# Altium schematic sheet 10_FPGA_power.SchDoc: FPGA power
size A3; Organization: Lime Microsystems; Address1: Surrey Tech Centre; Address2: Guildford GU2 7YG; Address3: Surrey; Address4: United Kingdom; Revision: SoDeRa-PCI v1.0; SheetNumber: 10; SheetTotal: 15
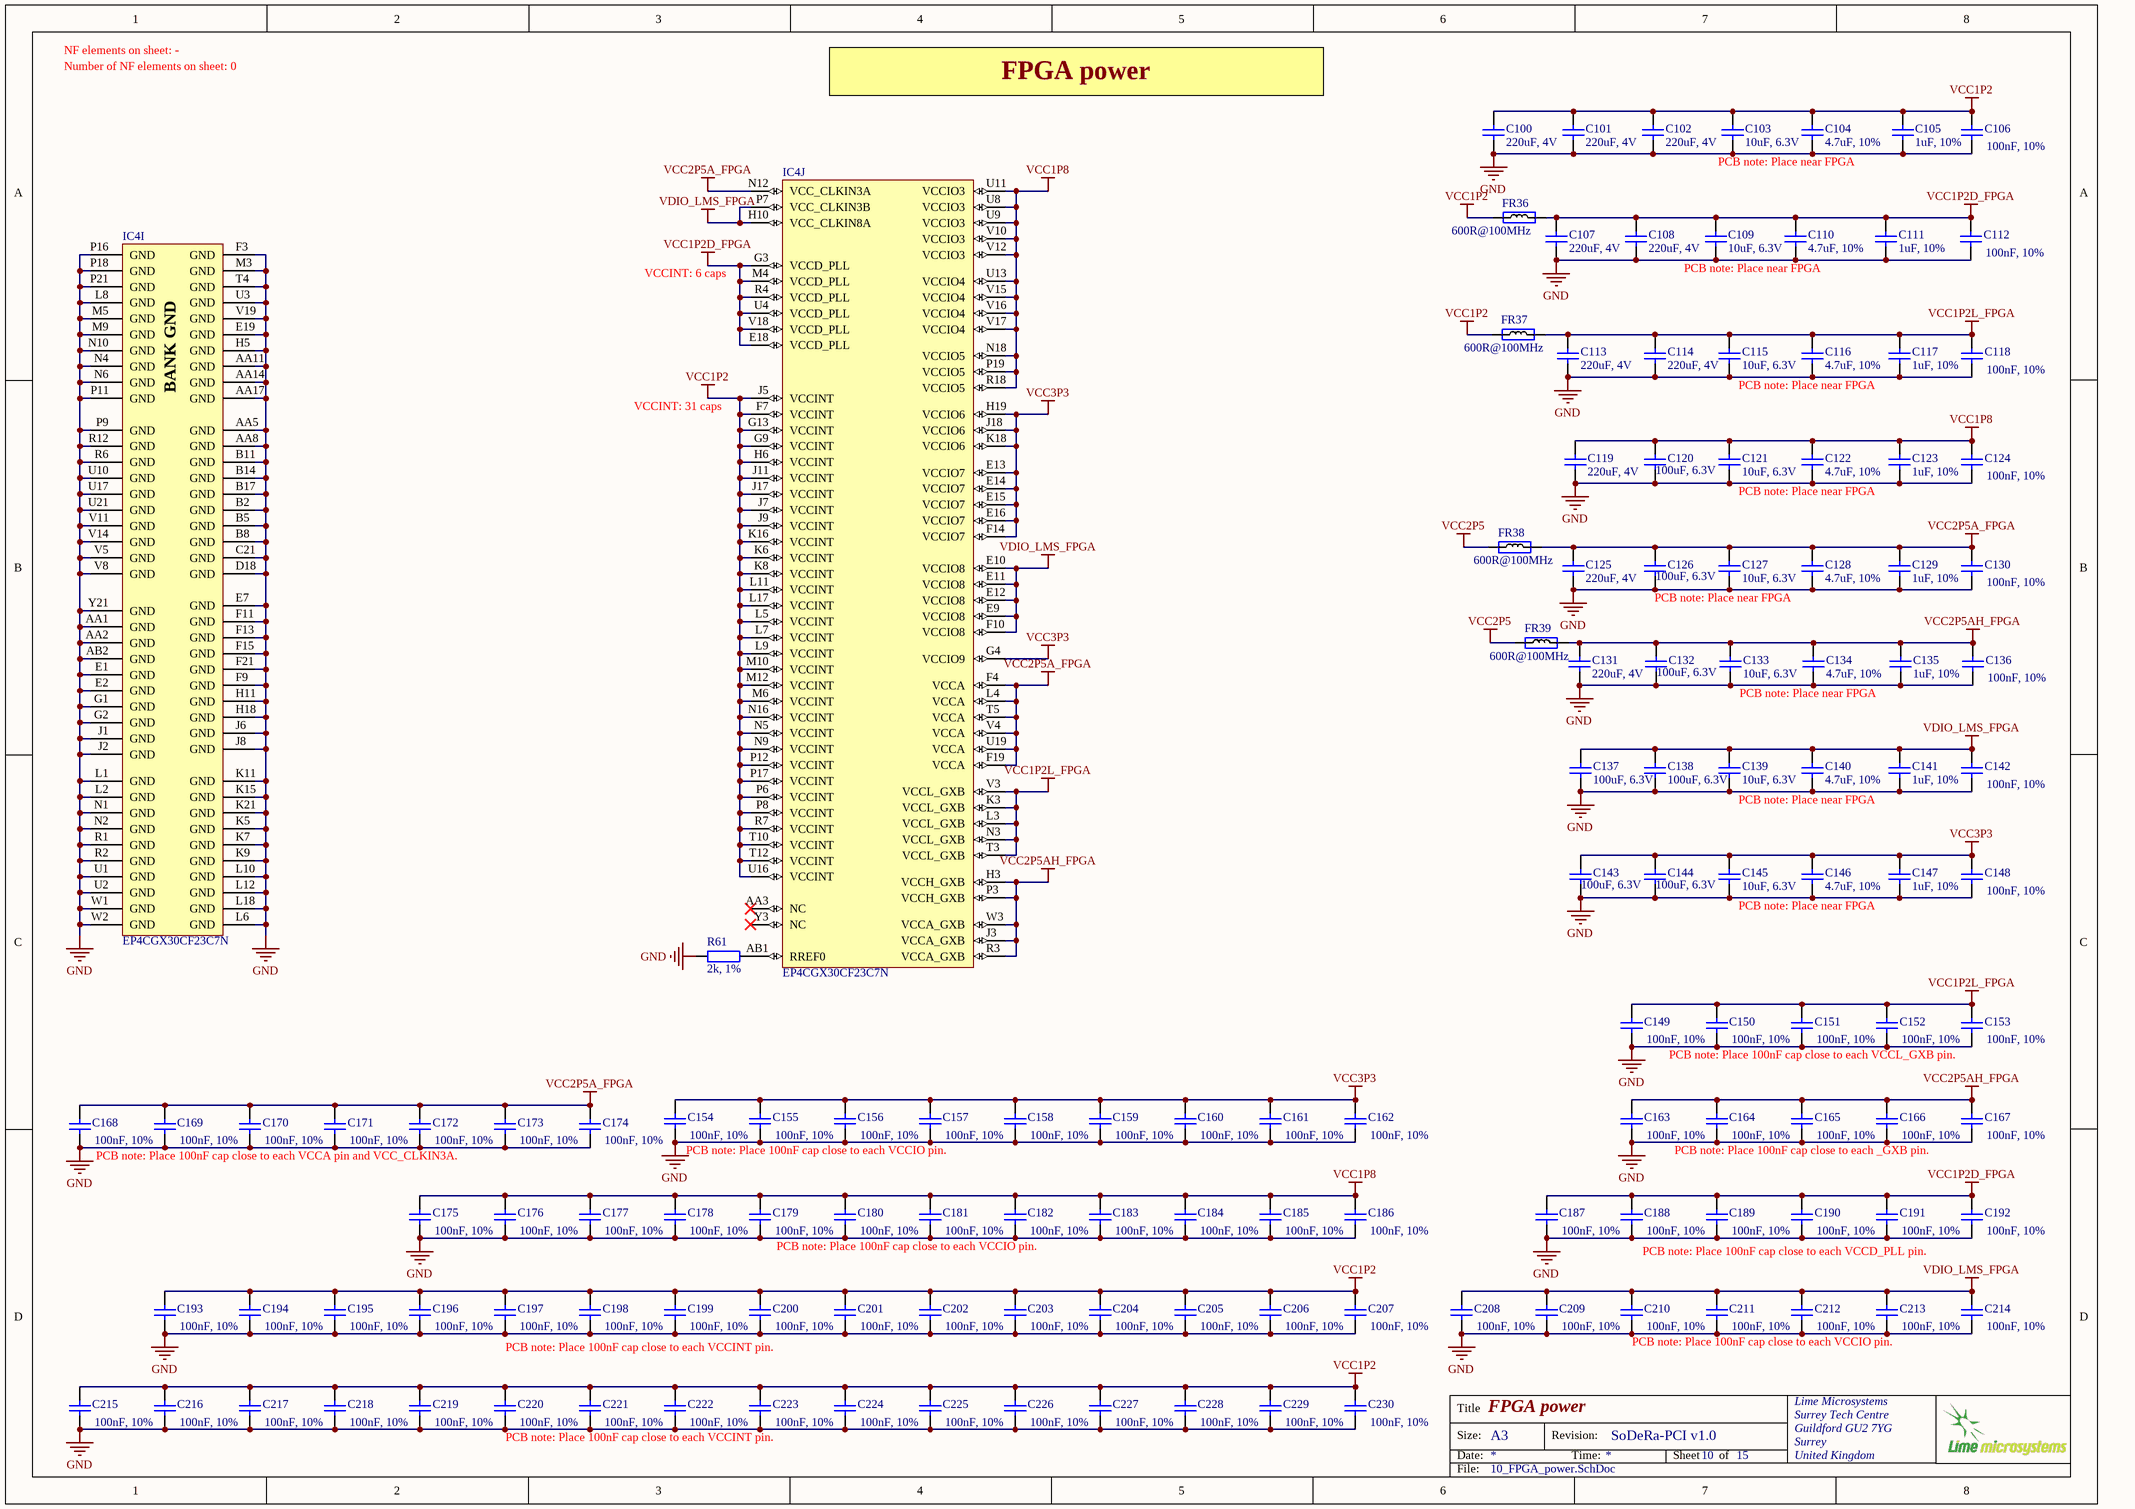
[diagram p0: 10_FPGA_power.SchDoc]

## Parts
C100  220uF, 4V  [CAP1206]
C101  220uF, 4V  [CAP1206]
C102  220uF, 4V  [CAP1206]
C103  10uF, 6.3V  [CAP0603]
C104  4.7uF, 10%  [CAP0603]
C105  1uF, 10%  [CAP0402]
C106  100nF, 10%  [CAP0402]
C107  220uF, 4V  [CAP1206]
C108  220uF, 4V  [CAP1206]
C109  10uF, 6.3V  [CAP0603]
C110  4.7uF, 10%  [CAP0603]
C111  1uF, 10%  [CAP0402]
C112  100nF, 10%  [CAP0402]
C113  220uF, 4V  [CAP1206]
C114  220uF, 4V  [CAP1206]
C115  10uF, 6.3V  [CAP0603]
C116  4.7uF, 10%  [CAP0603]
C117  1uF, 10%  [CAP0402]
C118  100nF, 10%  [CAP0402]
C119  220uF, 4V  [CAP1206]
C120  100uF, 6.3V  [CAP1206]
C121  10uF, 6.3V  [CAP0603]
C122  4.7uF, 10%  [CAP0603]
C123  1uF, 10%  [CAP0402]
C124  100nF, 10%  [CAP0402]
C125  220uF, 4V  [CAP1206]
C126  100uF, 6.3V  [CAP1206]
C127  10uF, 6.3V  [CAP0603]
C128  4.7uF, 10%  [CAP0603]
C129  1uF, 10%  [CAP0402]
C130  100nF, 10%  [CAP0402]
C131  220uF, 4V  [CAP1206]
C132  100uF, 6.3V  [CAP1206]
C133  10uF, 6.3V  [CAP0603]
C134  4.7uF, 10%  [CAP0603]
C135  1uF, 10%  [CAP0402]
C136  100nF, 10%  [CAP0402]
C137  100uF, 6.3V  [CAP1206]
C138  100uF, 6.3V  [CAP1206]
C139  10uF, 6.3V  [CAP0603]
C140  4.7uF, 10%  [CAP0603]
C141  1uF, 10%  [CAP0402]
C142  100nF, 10%  [CAP0402]
C143  100uF, 6.3V  [CAP1206]
C144  100uF, 6.3V  [CAP1206]
C145  10uF, 6.3V  [CAP0603]
C146  4.7uF, 10%  [CAP0603]
C147  1uF, 10%  [CAP0402]
C148  100nF, 10%  [CAP0402]
C149  100nF, 10%  [CAP0402]
C150  100nF, 10%  [CAP0402]
C151  100nF, 10%  [CAP0402]
C152  100nF, 10%  [CAP0402]
C153  100nF, 10%  [CAP0402]
C154  100nF, 10%  [CAP0402]
C155  100nF, 10%  [CAP0402]
C156  100nF, 10%  [CAP0402]
C157  100nF, 10%  [CAP0402]
C158  100nF, 10%  [CAP0402]
C159  100nF, 10%  [CAP0402]
C160  100nF, 10%  [CAP0402]
C161  100nF, 10%  [CAP0402]
C162  100nF, 10%  [CAP0402]
C163  100nF, 10%  [CAP0402]
C164  100nF, 10%  [CAP0402]
C165  100nF, 10%  [CAP0402]
C166  100nF, 10%  [CAP0402]
C167  100nF, 10%  [CAP0402]
C168  100nF, 10%  [CAP0402]
C169  100nF, 10%  [CAP0402]
C170  100nF, 10%  [CAP0402]
C171  100nF, 10%  [CAP0402]
C172  100nF, 10%  [CAP0402]
C173  100nF, 10%  [CAP0402]
C174  100nF, 10%  [CAP0402]
C175  100nF, 10%  [CAP0402]
C176  100nF, 10%  [CAP0402]
C177  100nF, 10%  [CAP0402]
C178  100nF, 10%  [CAP0402]
C179  100nF, 10%  [CAP0402]
C180  100nF, 10%  [CAP0402]
C181  100nF, 10%  [CAP0402]
C182  100nF, 10%  [CAP0402]
C183  100nF, 10%  [CAP0402]
C184  100nF, 10%  [CAP0402]
C185  100nF, 10%  [CAP0402]
C186  100nF, 10%  [CAP0402]
C187  100nF, 10%  [CAP0402]
C188  100nF, 10%  [CAP0402]
C189  100nF, 10%  [CAP0402]
C190  100nF, 10%  [CAP0402]
C191  100nF, 10%  [CAP0402]
C192  100nF, 10%  [CAP0402]
C193  100nF, 10%  [CAP0402]
C194  100nF, 10%  [CAP0402]
C195  100nF, 10%  [CAP0402]
C196  100nF, 10%  [CAP0402]
C197  100nF, 10%  [CAP0402]
C198  100nF, 10%  [CAP0402]
C199  100nF, 10%  [CAP0402]
C200  100nF, 10%  [CAP0402]
C201  100nF, 10%  [CAP0402]
C202  100nF, 10%  [CAP0402]
C203  100nF, 10%  [CAP0402]
C204  100nF, 10%  [CAP0402]
C205  100nF, 10%  [CAP0402]
C206  100nF, 10%  [CAP0402]
C207  100nF, 10%  [CAP0402]
C208  100nF, 10%  [CAP0402]
C209  100nF, 10%  [CAP0402]
C210  100nF, 10%  [CAP0402]
C211  100nF, 10%  [CAP0402]
C212  100nF, 10%  [CAP0402]
C213  100nF, 10%  [CAP0402]
C214  100nF, 10%  [CAP0402]
C215  100nF, 10%  [CAP0402]
C216  100nF, 10%  [CAP0402]
C217  100nF, 10%  [CAP0402]
C218  100nF, 10%  [CAP0402]
C219  100nF, 10%  [CAP0402]
C220  100nF, 10%  [CAP0402]
C221  100nF, 10%  [CAP0402]
C222  100nF, 10%  [CAP0402]
C223  100nF, 10%  [CAP0402]
C224  100nF, 10%  [CAP0402]
C225  100nF, 10%  [CAP0402]
C226  100nF, 10%  [CAP0402]
C227  100nF, 10%  [CAP0402]
C228  100nF, 10%  [CAP0402]
C229  100nF, 10%  [CAP0402]
C230  100nF, 10%  [CAP0402]
FR36  600R@100MHz  [RES0805]
FR37  600R@100MHz  [RES0805]
FR38  600R@100MHz  [RES0805]
FR39  600R@100MHz  [RES0805]
IC4  EP4CGX30CF23C7N  [ALTR-FBGA484_A-200]  (parts I,J of 10)
R61  2k, 1%  [RES0402]

## Nets
GND: C100.1 C101.1 C102.1 C103.1 C104.1 C105.2 C106.2 C107.1 C108.1 C109.1 C110.1 C111.2 C112.2 C113.1 C114.1 C115.1 C116.1 C117.1 C118.2 C119.1 C120.1 C121.1 C122.1 C123.1 C124.2 C125.1 C126.1 C127.1 C128.1 C129.1 C130.2 C131.1 C132.1 C133.1 C134.1 C135.1 C136.2 C137.1 C138.1 C139.1 C140.1 C141.1 C142.2 C143.1 C144.1 C145.1 C146.1 C147.1 C148.2 C149.2 C150.2 C151.2 C152.2 C153.2 C154.2 C155.2 C156.2 C157.2 C158.2 C159.2 C160.2 C161.2 C162.2 C163.2 C164.2 C165.2 C166.2 C167.2 C168.2 C169.2 C170.2 C171.2 C172.2 C173.2 C174.2 C175.2 C176.2 C177.2 C178.2 C179.2 C180.2 C181.2 C182.2 C183.2 C184.2 C185.2 C186.2 C187.2 C188.2 C189.2 C190.2 C191.2 C192.2 C193.2 C194.2 C195.2 C196.2 C197.2 C198.2 C199.2 C200.2 C201.2 C202.2 C203.2 C204.2 C205.2 C206.2 C207.2 C208.2 C209.2 C210.2 C211.2 C212.2 C213.2 C214.2 C215.2 C216.2 C217.2 C218.2 C219.2 C220.2 C221.2 C222.2 C223.2 C224.2 C225.2 C226.2 C227.2 C228.2 C229.2 C230.2 IC4.AA1(GND) IC4.AA2(GND) IC4.AA5(GND) IC4.AA8(GND) IC4.AA11(GND) IC4.AA14(GND) IC4.AA17(GND) IC4.AB2(GND) IC4.B2(GND) IC4.B5(GND) IC4.B8(GND) IC4.B11(GND) IC4.B14(GND) IC4.B17(GND) IC4.C21(GND) IC4.D18(GND) IC4.E1(GND) IC4.E2(GND) IC4.E7(GND) IC4.E19(GND) IC4.F3(GND) IC4.F9(GND) IC4.F11(GND) IC4.F13(GND) IC4.F15(GND) IC4.F21(GND) IC4.G1(GND) IC4.G2(GND) IC4.H5(GND) IC4.H11(GND) IC4.H18(GND) IC4.J1(GND) IC4.J2(GND) IC4.J6(GND) IC4.J8(GND) IC4.K5(GND) IC4.K7(GND) IC4.K9(GND) IC4.K11(GND) IC4.K15(GND) IC4.K21(GND) IC4.L1(GND) IC4.L2(GND) IC4.L6(GND) IC4.L8(GND) IC4.L10(GND) IC4.L12(GND) IC4.L18(GND) IC4.M3(GND) IC4.M5(GND) IC4.M9(GND) IC4.N1(GND) IC4.N2(GND) IC4.N4(GND) IC4.N6(GND) IC4.N10(GND) IC4.P9(GND) IC4.P11(GND) IC4.P16(GND) IC4.P18(GND) IC4.P21(GND) IC4.R1(GND) IC4.R2(GND) IC4.R6(GND) IC4.R12(GND) IC4.T4(GND) IC4.U1(GND) IC4.U2(GND) IC4.U3(GND) IC4.U10(GND) IC4.U17(GND) IC4.U21(GND) IC4.V5(GND) IC4.V8(GND) IC4.V11(GND) IC4.V14(GND) IC4.V19(GND) IC4.W1(GND) IC4.W2(GND) IC4.Y21(GND) R61.2
VCC1P2: C100.2 C101.2 C102.2 C103.2 C104.2 C105.1 C106.1 C193.1 C194.1 C195.1 C196.1 C197.1 C198.1 C199.1 C200.1 C201.1 C202.1 C203.1 C204.1 C205.1 C206.1 C207.1 C215.1 C216.1 C217.1 C218.1 C219.1 C220.1 C221.1 C222.1 C223.1 C224.1 C225.1 C226.1 C227.1 C228.1 C229.1 C230.1 FR36.1 FR37.1 IC4.F7(VCCINT) IC4.G9(VCCINT) IC4.G13(VCCINT) IC4.H6(VCCINT) IC4.J5(VCCINT) IC4.J7(VCCINT) IC4.J9(VCCINT) IC4.J11(VCCINT) IC4.J17(VCCINT) IC4.K6(VCCINT) IC4.K8(VCCINT) IC4.K16(VCCINT) IC4.L5(VCCINT) IC4.L7(VCCINT) IC4.L9(VCCINT) IC4.L11(VCCINT) IC4.L17(VCCINT) IC4.M6(VCCINT) IC4.M10(VCCINT) IC4.M12(VCCINT) IC4.N5(VCCINT) IC4.N9(VCCINT) IC4.N16(VCCINT) IC4.P6(VCCINT) IC4.P8(VCCINT) IC4.P12(VCCINT) IC4.P17(VCCINT) IC4.R7(VCCINT) IC4.T10(VCCINT) IC4.T12(VCCINT) IC4.U16(VCCINT)
VCC1P2D_FPGA: C107.2 C108.2 C109.2 C110.2 C111.1 C112.1 C187.1 C188.1 C189.1 C190.1 C191.1 C192.1 FR36.2 IC4.E18(VCCD_PLL) IC4.G3(VCCD_PLL) IC4.M4(VCCD_PLL) IC4.R4(VCCD_PLL) IC4.U4(VCCD_PLL) IC4.V18(VCCD_PLL)
VCC1P2L_FPGA: C113.2 C114.2 C115.2 C116.2 C117.2 C118.1 C149.1 C150.1 C151.1 C152.1 C153.1 FR37.2 IC4.K3(VCCL_GXB) IC4.L3(VCCL_GXB) IC4.N3(VCCL_GXB) IC4.T3(VCCL_GXB) IC4.V3(VCCL_GXB)
VCC1P8: C119.2 C120.2 C121.2 C122.2 C123.2 C124.1 C175.1 C176.1 C177.1 C178.1 C179.1 C180.1 C181.1 C182.1 C183.1 C184.1 C185.1 C186.1 IC4.N18(VCCIO5) IC4.P19(VCCIO5) IC4.R18(VCCIO5) IC4.U8(VCCIO3) IC4.U9(VCCIO3) IC4.U11(VCCIO3) IC4.U13(VCCIO4) IC4.V10(VCCIO3) IC4.V12(VCCIO3) IC4.V15(VCCIO4) IC4.V16(VCCIO4) IC4.V17(VCCIO4)
VCC2P5: FR38.1 FR39.1
VCC2P5A_FPGA: C125.2 C126.2 C127.2 C128.2 C129.2 C130.1 C168.1 C169.1 C170.1 C171.1 C172.1 C173.1 C174.1 FR38.2 IC4.F4(VCCA) IC4.F19(VCCA) IC4.L4(VCCA) IC4.N12(VCC_CLKIN3A) IC4.T5(VCCA) IC4.U19(VCCA) IC4.V4(VCCA)
VCC2P5AH_FPGA: C131.2 C132.2 C133.2 C134.2 C135.2 C136.1 C163.1 C164.1 C165.1 C166.1 C167.1 FR39.2 IC4.H3(VCCH_GXB) IC4.J3(VCCA_GXB) IC4.P3(VCCH_GXB) IC4.R3(VCCA_GXB) IC4.W3(VCCA_GXB)
VCC3P3: C143.2 C144.2 C145.2 C146.2 C147.2 C148.1 C154.1 C155.1 C156.1 C157.1 C158.1 C159.1 C160.1 C161.1 C162.1 IC4.E13(VCCIO7) IC4.E14(VCCIO7) IC4.E15(VCCIO7) IC4.E16(VCCIO7) IC4.F14(VCCIO7) IC4.G4(VCCIO9) IC4.H19(VCCIO6) IC4.J18(VCCIO6) IC4.K18(VCCIO6)
VDIO_LMS_FPGA: C137.2 C138.2 C139.2 C140.2 C141.2 C142.1 C208.1 C209.1 C210.1 C211.1 C212.1 C213.1 C214.1 IC4.E9(VCCIO8) IC4.E10(VCCIO8) IC4.E11(VCCIO8) IC4.E12(VCCIO8) IC4.F10(VCCIO8) IC4.H10(VCC_CLKIN8A) IC4.P7(VCC_CLKIN3B)
NetIC4_AB1: IC4.AB1(RREF0) R61.1

Not connected (* = marked no-connect by the designer): IC4 AA3(NC)* Y3(NC)*

## Notes on the sheet
- NF elements on sheet: -
- Number of NF elements on sheet: 0
- FPGA power
- PCB note: Place near FPGA
- (near IC4) VCCINT: 6 caps
- VCCINT: 31 caps
- PCB note: Place 100nF cap close to each VCCL_GXB pin.
- PCB note: Place 100nF cap close to each VCCA pin and VCC_CLKIN3A.
- PCB note: Place 100nF cap close to each VCCIO pin.
- PCB note: Place 100nF cap close to each _GXB pin.
- PCB note: Place 100nF cap close to each VCCD_PLL pin.
- PCB note: Place 100nF cap close to each VCCINT pin.
- Title
- Size:
- Date:
- A3
- Revision:
- Time:
- Sheet
- of
- File:
- (in symbol EP4CGX30CF23C7N, part I) BANK GND

## Library data of the parts
C100-C102 C107 C108 C113 C114 C119 C125 C131 = Cap_1206: Manufacturer Part Number: GRM31CR60G227ME11L; Manufacturer: Murata Electronics North America; Capacitance: 220µF; Temperature Coefficient: X5R; Tolerance: ±20%; Package / Case: 1206 (3216 Metric); Supplier 1: Digi-Key; Packaging: Cut Tape (CT); Size / Dimension: 0.126" L x 0.063" W (3.20mm x 1.60mm); Operating Temperature: -55°C ~ 85°C; Voltage - Rated: 4V; Mounting Type: Surface Mount, MLCC; Ratings: -; Supplier Part Number 1: 490-9774-1-ND; Category: Capacitors; Lead Spacing: -; Lead Style: -; Applications: General Purpose; Features: -; Height - Seated (Max): -; Thickness (Max): 0.075" (1.90mm); RoHS: RoHS Compliant; Value: 220uF, 4V
C103 C109 C115 C121 C127 C133 C139 C145 = Cap_0603: Manufacturer Part Number 1: CC0603MRX5R5BB106; Capacitance: 10µF; Tolerance: ±20%; Supplier 1: Digi-Key; Supplier Part Number 1: 311-1448-2-ND; Package / Case: 0603 (1608 Metric); Category: Capacitors; Voltage - Rated: 6.3V; Value: 10uF, 6.3V
C104 C110 C116 C122 C128 C134 C140 C146 = Cap_0603: Manufacturer Part Number 1: CGB3B1X5R1A475K055AC; Voltage Rating DC: 10 V; Temperature Coefficient / Code: +/- 15 %; Supplier 1: Mouser; Supplier Part Number 1: 810-CGB3B1X5R1A475KC; Capacitance: 4.7 uF; Operating Temperature Range: - 55 C to + 85 C; Category: Multilayer Ceramic Capacitors MLCC - SMD/SMT; Case Code - in: 0603; Package / Case: 0603 (1608 metric); Tolerance: 10 %; value: 4.7uF, 10%
C105 C111 C117 C123 C129 C135 C141 C147 = Cap_0402: Manufacturer Part Number 1: GRM155R61A105KE15J; Manufacturer: TDK; Voltage Rating: 10; Product Range: TDK - C Series; Ceramic Capacitor Case: 0402 [1005 Metric]; Capacitance: 1; Dielectric Characteristic: X6; Value: 1uF, 10%; Supplier 1: Newark; Supplier Part Number 1: 490-6298-2-ND; Capacitance Tolerance: ± 10%; MSL: -; RoHS: YES
C106 C112 C118 C124 C130 C136 C142 C148-C230 = Cap_0603: Manufacturer: Murata; Manufacturer Part Number 1: GRM155R71C104KA88D; Brand: Murata Electronics; Type: General Purpose MLCC; Capacitance: 0.1 uF; Temperature Coefficient / Code: +/- 15 %; Voltage Rating DC: 16 V; Supplier 1: Mouser; Supplier Part Number 1: 81-GRM155R71C104KA88; Tolerance: 10 %; Case Code - in: 0402; Category: Multilayer Ceramic Capacitors MLCC - SMD/SMT; Value: 100nF, 10%; Manufacturer Part Number: GRM155R71C104KA88D
C120 C126 C132 C137 C138 C143 C144 = Cap_1206: Manufacturer: MURATA; Manufacturer Part Number 1: GRM31CR60J107ME39L.; Capacitance Tolerance: ± 20%; Ceramic Capacitor Case: 1206 [3216 Metric]; Voltage Rating: 6.3; value: 100uF, 6.3V; Supplier Part Number 1: 1735535; Supplier 1: Farnell
FR36-FR39 = Ferrite: Manufacturer Part Number 1: MPZ2012S601AT000; Manufacturer: TDK Corporation; Filter Type: Differential Mode - Single; Impedance @ Frequency: 600 Ohm @ 100MHz; DC Resistance (DCR): 100 mOhm Max; Current Rating: 2A; Supplier 1: Digi-Key; Supplier Part Number 1: 445-2206-2-ND; Mounting Type: Surface Mount; RoHS: RoHS Compliant; Height (Max): 0.041" (1.05mm); Packaging: Tape & Reel (TR); Category: Filters; Package / Case: 0805 (2012 Metric); Size / Dimension: 0.079" L x 0.049" W (2.00mm x 1.25mm)
IC4 = EP4CGX30CF23C7N: Manufacturer: Altera; Voltage - Supply: 1.16 V ~ 1.24 V; Number of I/O: 290; Total RAM Bits: 1105920; Number of Logic Elements/Cells: 29440; Number of LABs/CLBs: 1840; Supplier 1: Digi-Key; Package / Case: 484-BGA; Operating Temperature: 0°C ~ 85°C; Mounting Type: Surface Mount; Number of Gates: -; Supplier Device Package: 484-FBGA (23x23); Category: Integrated Circuits (ICs); RoHS: RoHS Compliant; Supplier Part Number 1: 544-2730-ND; Manufacturer Part Number 1: EP4CGX30CF23C7N
R61 = Res_0402: Manufacturer: Yageo; Manufacturer Part Number: RC0402FR-072KL; Power (Watts): 0.063W, 1/16W; Temperature Coefficient: ±100ppm/°C; Packaging: Cut Tape (CT); Size / Dimension: 0.039" L x 0.020" W (1.00mm x 0.50mm); Operating Temperature: -55°C ~ 155°C; Resistance (Ohms): 2k; Number of Terminations: 2; Supplier Device Package: 0402; Tolerance: ±1%; Features: Moisture Resistant; Category: Resistors; Height: 0.016" (0.40mm); Composition: Thick Film; Supplier 1: Digi-Key; Supplier Part Number 1: 311-2KLRCT-ND; Package / Case: 0402 (1005 Metric); RoHS: RoHS Compliant; Value: 2k, 1%